# Altium schematic sheet ZYNQ400-POWER.SchDoc
size A3
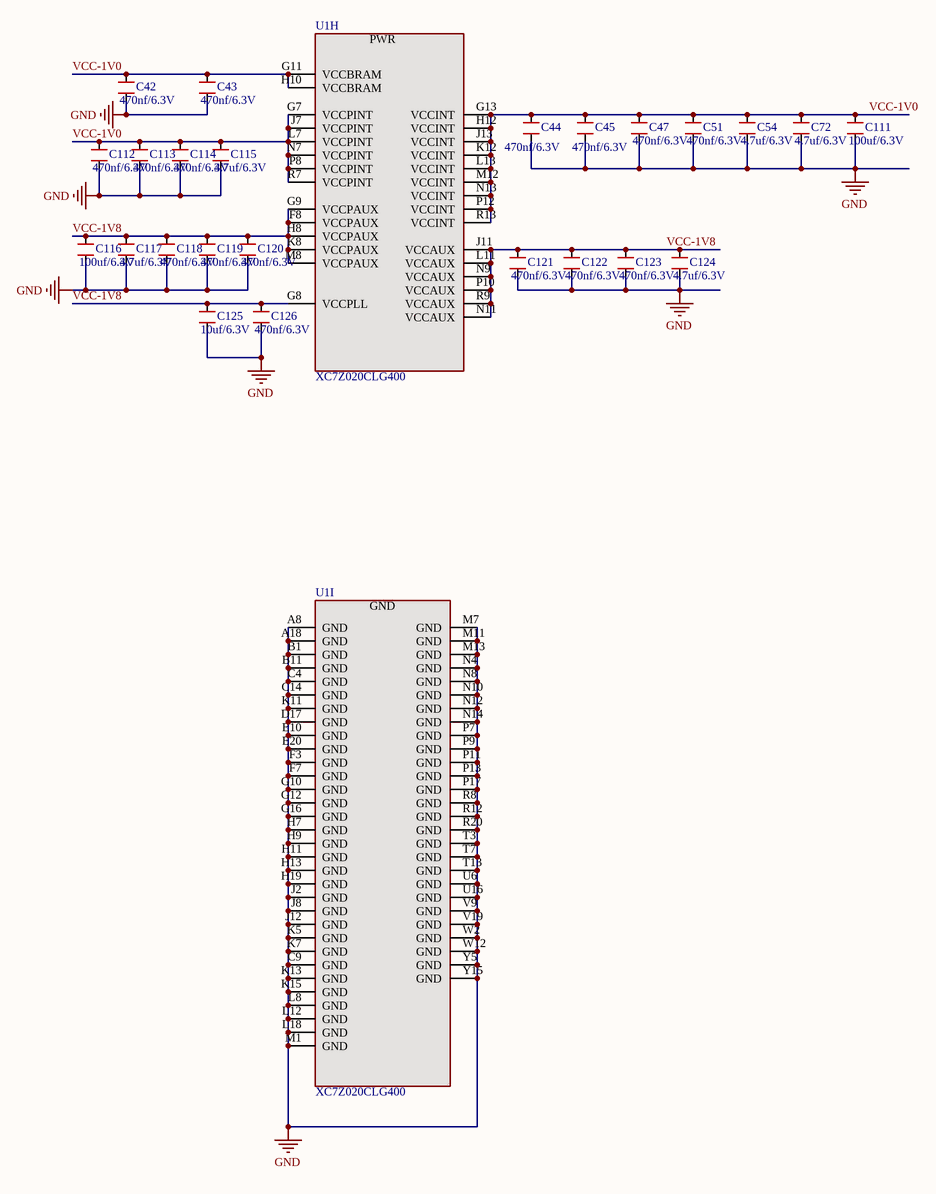
[diagram p0: ZYNQ400-POWER.SchDoc]

## Parts
C42  470nf/6.3V  [0402]
C43  470nf/6.3V  [0402]
C44  470nf/6.3V  [0402]
C45  470nf/6.3V  [0402]
C47  470nf/6.3V  [0402]
C51  470nf/6.3V  [0402]
C54  4.7uf/6.3V  [0402]
C72  4.7uf/6.3V  [0402]
C111  100uf/6.3V  [0805]
C112  470nf/6.3V  [0402]
C113  470nf/6.3V  [0402]
C114  470nf/6.3V  [0402]
C115  4.7uf/6.3V  [0402]
C116  100uf/6.3V  [0805]
C117  4.7uf/6.3V  [0402]
C118  470nf/6.3V  [0402]
C119  470nf/6.3V  [0402]
C120  470nf/6.3V  [0402]
C121  470nf/6.3V  [0402]
C122  470nf/6.3V  [0402]
C123  470nf/6.3V  [0402]
C124  4.7uf/6.3V  [0402]
C125  10uf/6.3V  [0603]
C126  470nf/6.3V  [0402]
U1  XC7Z020CLG400  [CLG400]  (parts H,I of 9)

## Nets
GND: C42.2 C43.2 C44.2 C45.2 C47.2 C51.2 C54.2 C72.2 C111.2 C112.2 C113.2 C114.2 C115.2 C116.2 C117.2 C118.2 C119.2 C120.2 C121.2 C122.2 C123.2 C124.2 C125.2 C126.2 U1.A8(GND) U1.A18(GND) U1.B1(GND) U1.B11(GND) U1.C4(GND) U1.C9(GND) U1.C14(GND) U1.D17(GND) U1.E10(GND) U1.E20(GND) U1.F3(GND) U1.F7(GND) U1.G10(GND) U1.G12(GND) U1.G16(GND) U1.H7(GND) U1.H9(GND) U1.H11(GND) U1.H13(GND) U1.H19(GND) U1.J2(GND) U1.J8(GND) U1.J12(GND) U1.K5(GND) U1.K7(GND) U1.K11(GND) U1.K13(GND) U1.K15(GND) U1.L8(GND) U1.L12(GND) U1.L18(GND) U1.M1(GND) U1.M7(GND) U1.M11(GND) U1.M13(GND) U1.N4(GND) U1.N8(GND) U1.N10(GND) U1.N12(GND) U1.N14(GND) U1.P7(GND) U1.P9(GND) U1.P11(GND) U1.P13(GND) U1.P17(GND) U1.R8(GND) U1.R12(GND) U1.R20(GND) U1.T3(GND) U1.T7(GND) U1.T13(GND) U1.U6(GND) U1.U16(GND) U1.V9(GND) U1.V19(GND) U1.W2(GND) U1.W12(GND) U1.Y5(GND) U1.Y15(GND)
VCC-1V0: C42.1 C43.1 C44.1 C45.1 C47.1 C51.1 C54.1 C72.1 C111.1 C112.1 C113.1 C114.1 C115.1 U1.G7(VCCPINT) U1.G11(VCCBRAM) U1.G13(VCCINT) U1.H10(VCCBRAM) U1.H12(VCCINT) U1.J7(VCCPINT) U1.J13(VCCINT) U1.K12(VCCINT) U1.L7(VCCPINT) U1.L13(VCCINT) U1.M12(VCCINT) U1.N7(VCCPINT) U1.N13(VCCINT) U1.P8(VCCPINT) U1.P12(VCCINT) U1.R7(VCCPINT) U1.R13(VCCINT)
VCC-1V8: C116.1 C117.1 C118.1 C119.1 C120.1 C121.1 C122.1 C123.1 C124.1 C125.1 C126.1 U1.F8(VCCPAUX) U1.G8(VCCPLL) U1.G9(VCCPAUX) U1.H8(VCCPAUX) U1.J11(VCCAUX) U1.K8(VCCPAUX) U1.L11(VCCAUX) U1.M8(VCCPAUX) U1.N9(VCCAUX) U1.N11(VCCAUX) U1.P10(VCCAUX) U1.R9(VCCAUX)

## Notes on the sheet
- (in symbol XC7Z020-CLG400, part H) PWR

## Library data of the parts
C42-C45 C47 C51 C54 C72 C111-C126 = CAPACITOR: Generic Capacitor; DPN: *; Manufacturer: *
U1 = XC7Z020-CLG400: Zynq 7000 FPGA 20 Die, in a CSG 484 Package; Manufacturer: Xilinx; DPN: *; Die: *